# EAGLE design Lawnbot400_arduino3 (EAGLE 5.06)
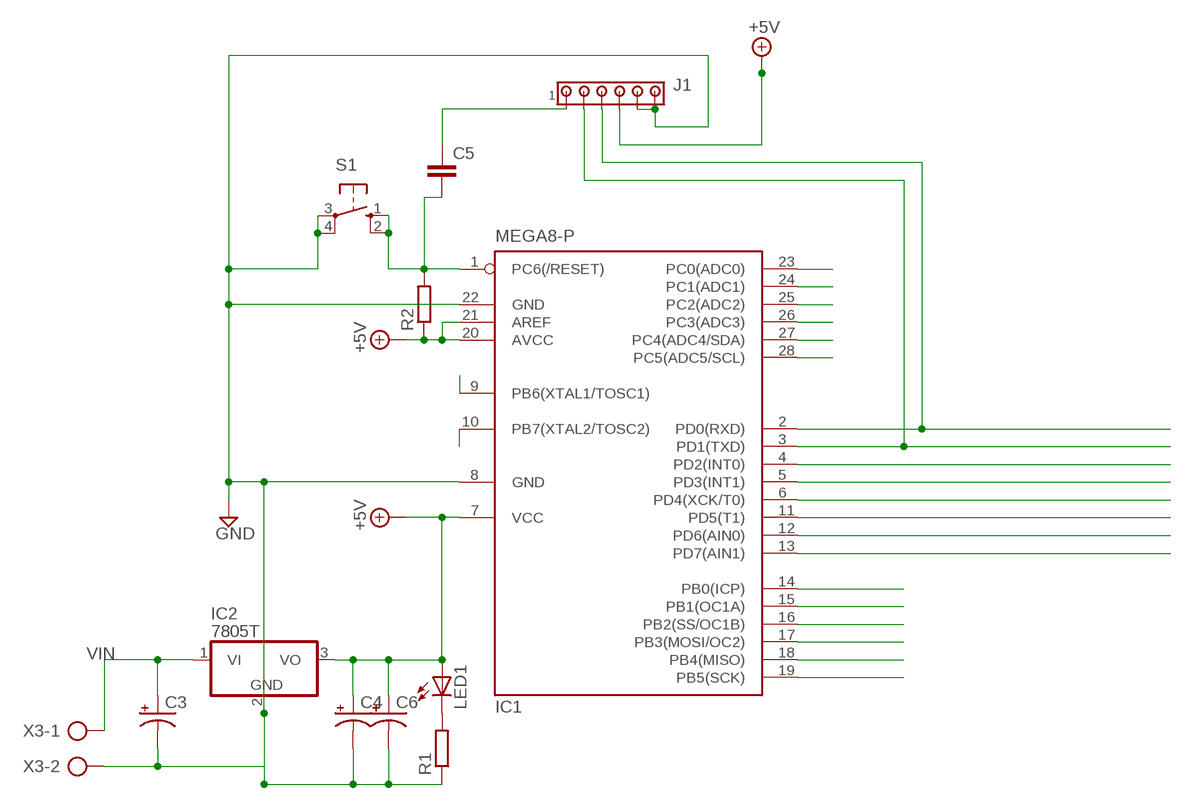
[diagram p0: schematic, sheet 1]

## Parts
C3  CPOL-USE2.5-6  [E2,5-6]
C4  CPOL-USE2.5-7  [E2,5-7]
C5  C-EU075-042X103  [C075-042X103]
C6  CPOL-USE2.5-6  [E2,5-6]
IC1  MEGA8-P  [DIL28-3]
IC2  7805T  [TO220H]
J1  MTA06-100  [10X06MTA]
LED1  LED3MM  [LED3MM]
R1  R-EU_0204/5  [0204/5]
R2  R-EU_0204/5  [0204/5]
S1  10-XX  [B3F-10XX]
X3  AK500/2  [AK500/2]

## Nets
+5V: C4.+ C6.+ IC1.7(VCC) IC1.20(AVCC) IC1.21(AREF) IC2.3(VO) J1.3 LED1.A R2.1
GND: C3.- C4.- C6.- IC1.8(GND) IC1.22(GND) IC2.2(GND) J1.1 J1.2 R1.1 S1.3(P) S1.4(P1) X3.2
N$1: LED1.K(C) R1.2
N$2: C5.2 IC1.1(PC6(/RESET)) R2.2 S1.1(S) S1.2(S1)
N$3: IC1.19(PB5(SCK))
N$4: C5.1 J1.6
N$5: IC1.18(PB4(MISO))
N$6: IC1.17(PB3(MOSI/OC2))
N$7: IC1.9(PB6(XTAL1/TOSC1))
N$8: IC1.4(PD2(INT0))
N$9: IC1.2(PD0(RXD)) J1.4
N$10: IC1.3(PD1(TXD)) J1.5
N$11: IC1.6(PD4(XCK/T0))
N$12: IC1.11(PD5(T1))
N$13: IC1.12(PD6(AIN0))
N$14: IC1.13(PD7(AIN1))
N$15: IC1.14(PB0(ICP))
N$16: IC1.15(PB1(OC1A))
N$17: IC1.5(PD3(INT1))
N$19: IC1.10(PB7(XTAL2/TOSC2))
N$23: IC1.28(PC5(ADC5/SCL))
N$24: IC1.27(PC4(ADC4/SDA))
N$25: IC1.26(PC3(ADC3))
N$26: IC1.25(PC2(ADC2))
N$27: IC1.24(PC1(ADC1))
N$28: IC1.23(PC0(ADC0))
N$29: IC1.16(PB2(SS/OC1B))
VIN: C3.+ IC2.1(VI) X3.1

## Library data of the parts
C3 C4 C6 = rcl:CPOL-US: POLARIZED CAPACITOR, American symbol
C5 = rcl:C-EU: CAPACITOR, European symbol
IC1 = atmel:MEGA8-P: MICROCONTROLLER 8 Kbytes FLASH, 1 kbytes SRAM, 512 bytes EEPROM, USART, 4-channel 10 bit ADC, 2-channel 8 bit ADC Pin compatible with Atmega48, ATMega88, ATMega168 Source: avr.lbr
IC2 = linear:78*: Positive VOLTAGE REGULATOR Source: http://cache.national.com/ds/LM/LM78L05.pdf http://www.fairchildsemi.com/ds/LM/LM7805.pdf
J1 = con-amp:MTA06-100: AMP connector
LED1 = led:LED: LED OSRAM: - CHIPLED LG R971, LG N971, LY N971, LG Q971, LY Q971, LO R971, LY R971 LH N974, LH R974 LS Q976, LO Q976, LY Q976 LO Q996 - Hyper CHIPLED LW Q18S LB Q993, LB Q99A, LB R99A - SideLED LS A670, LO A670, LY A670, LG A670, LP A670 LB A673, LV A673, LT A673, LW A673 LH A674 LY A675 LS A676, LA A676, LO A676, LY A676, LW A676 LS A679, LY A679, LG A679 - Hyper Micro SIDELED® LS Y876, LA Y876, LO Y876, LY Y876 LT Y87S - SmartLED LW L88C, LW L88S LB L89C, LB L89S, LG L890 LS L89K, LO L89K, LY L89K LS L896, LA L896, LO L896, LY L896 - TOPLED LS T670, LO T670, LY T670, LG T670, LP T670 LSG T670, LSP T670, LSY T670, LOP T670, LYG T670 LG T671, LOG T671, LSG T671 LB T673, LV T673, LT T673, LW T673 LH T674 LS T676, LA T676, LO T676, LY T676, LB T676, LH T676, LSB T676, LW T676 LB T67C, LV T67C, LT T67C, LS T67K, LO T67K, LY T67K, LW E67C LS E67B, LA E67B, LO E67B, LY E67B, LB E67C, LV E67C, LT E67C LW T67C LS T679, LY T679, LG T679 LS T770, LO T770, LY T770, LG T770, LP T770 LB T773, LV T773, LT T773, LW T773 LH T774 LS E675, LA E675, LY E675, LS T675 LS T776, LA T776, LO T776, LY T776, LB T776 LHGB T686 LT T68C, LB T68C - Hyper Mini TOPLED® LB M676 - Mini TOPLED Santana® LG M470 LS M47K, LO M47K, LY M47K Source: http://www.osram.convergy.de LUXEON: - LUMILED® LXK2-PW12-R00, LXK2-PW12-S00, LXK2-PW14-U00, LXK2-PW14-V00 LXK2-PM12-R00, LXK2-PM12-S00, LXK2-PM14-U00 LXK2-PE12-Q00, LXK2-PE12-R00, LXK2-PE12-S00, LXK2-PE14-T00, LXK2-PE14-U00 LXK2-PB12-K00, LXK2-PB12-L00, LXK2-PB12-M00, LXK2-PB14-N00, LXK2-PB14-P00, LXK2-PB14-Q00 LXK2-PR12-L00, LXK2-PR12-M00, LXK2-PR14-Q00, LXK2-PR14-R00 LXK2-PD12-Q00, LXK2-PD12-R00, LXK2-PD12-S00 LXK2-PH12-R00, LXK2-PH12-S00 LXK2-PL12-P00, LXK2-PL12-Q00, LXK2-PL12-R00 Source: www.luxeon.com KINGBRIGHT: KA-3528ASYC Source: www.kingbright.com
R1 R2 = resistor:R-EU_: RESISTOR, European symbol
S1 = switch-omron:10-XX: OMRON SWITCH
X3 = con-ptr500:AK500/2: CONNECTOR

## Board
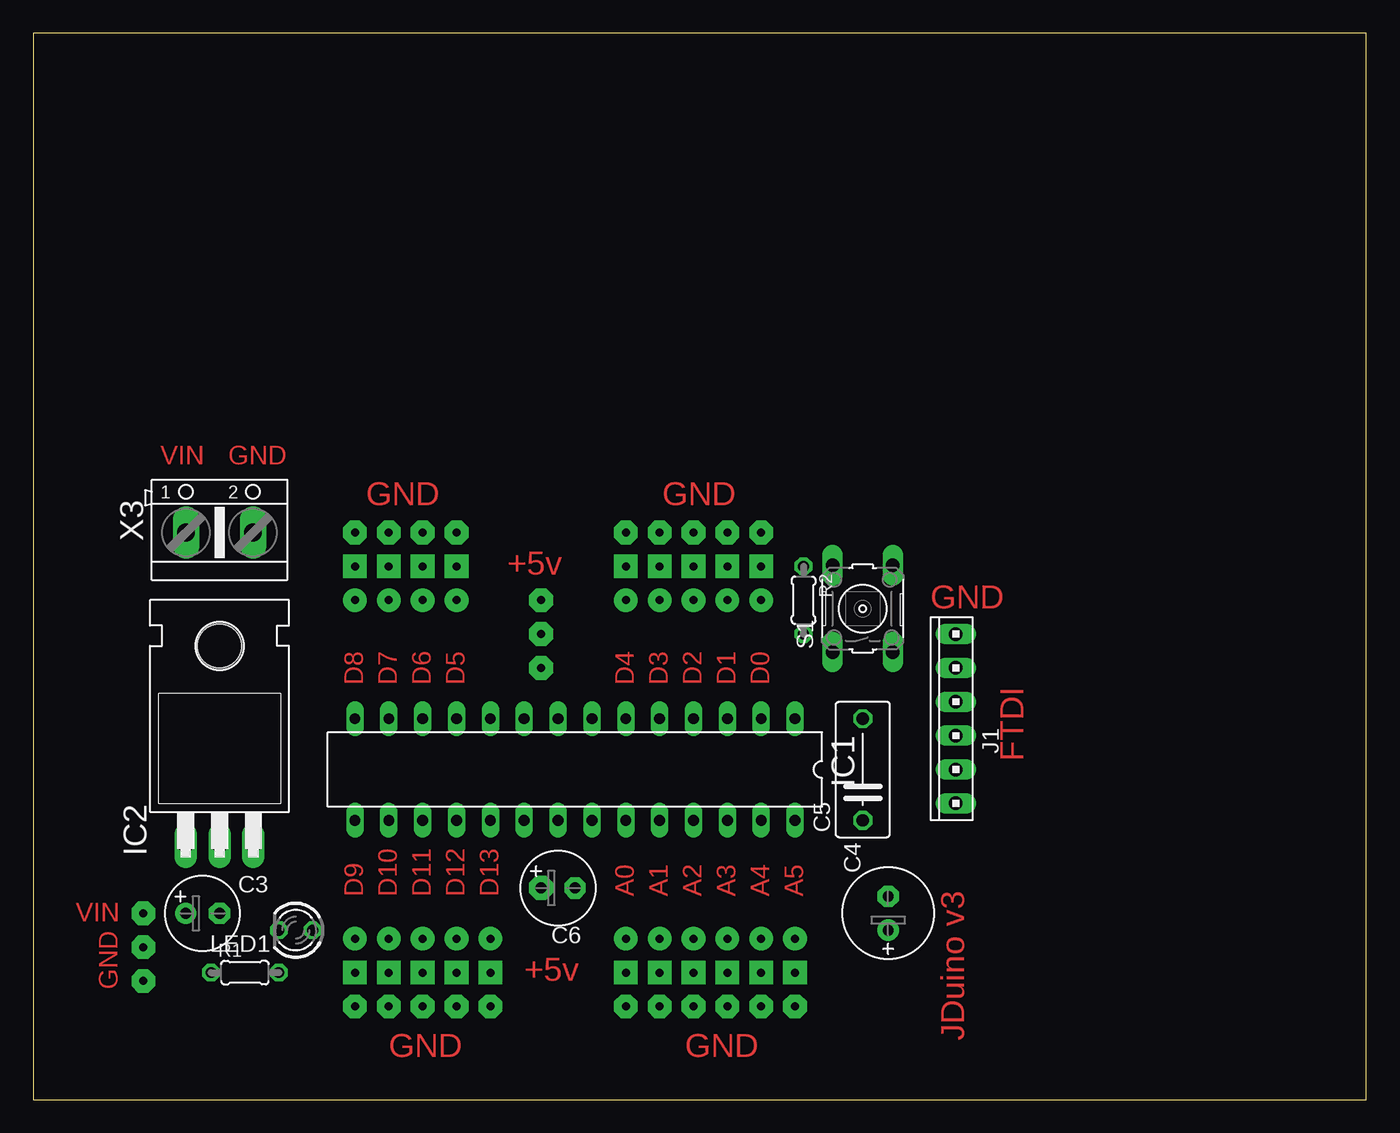
[diagram p1: board, top side]
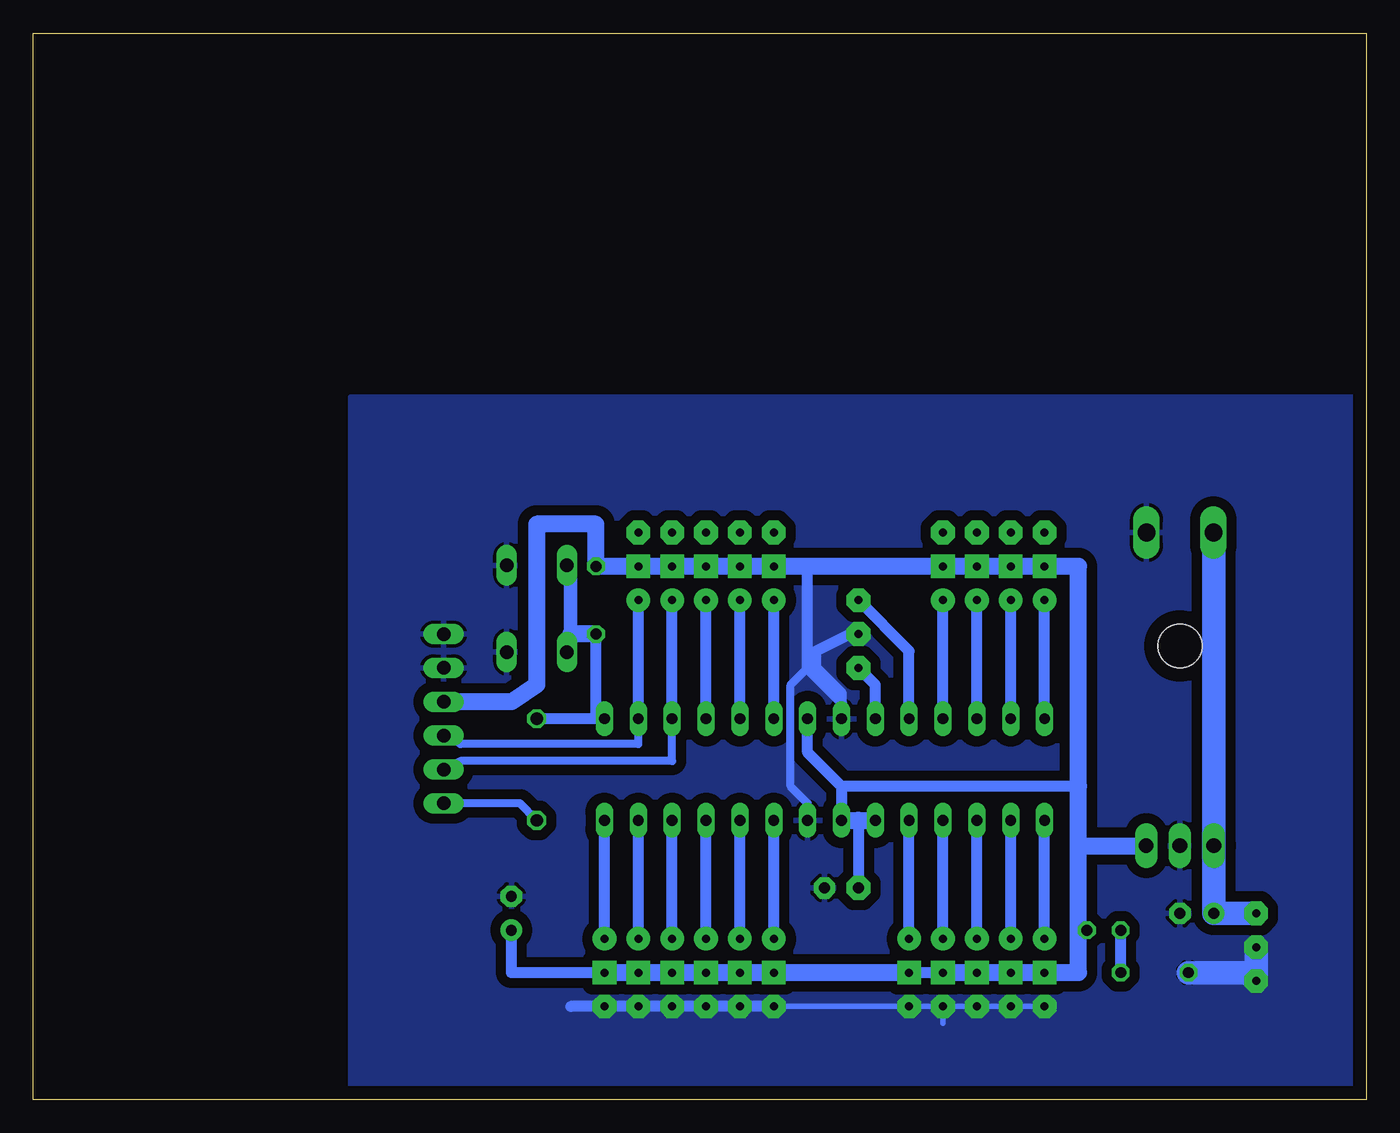
[diagram p2: board, bottom side, seen from below]

Size 100 x 80 mm. Coordinates in mm from the lower left corner, seen from the top.
Outline: 0,0 100,0 100,80 0,80 0,0
Copper layers (1*16): Top 0.035mm / dielectric 1.5mm / Bottom 0.035mm
Design rules "default *": minimum track width 10mil, minimum drill 24mil, track to track 30mil, track to pad 25mil, pad to pad 8mil, via to via 8mil, smd to smd 8mil, copper to edge 40mil, drill to drill 8mil, minimum pad ring 10mil, minimum via ring 8mil, stop-mask expansion 4mil, vias tented up to drill 0mil, thermal gap 10mil

### Footprints (pad centres in the part's own frame; a part is rotated, then mirrored left to right if it is on the bottom)
E2,5-6 = drill 0.813 pad 1.6 round: + -1.27,0 | drill 0.813 pad 1.6 octagon: - 1.27,0
E2,5-7 = drill 0.813 pad 1.6 round: + -1.27,0 | drill 0.813 pad 1.6 octagon: - 1.27,0
C075-042X103 = drill 0.914 octagon: 1 -3.81,0; 2 3.81,0
DIL28-3 = drill 0.813 long: 1 -16.51,-3.81; 2 -13.97,-3.81; 3 -11.43,-3.81; 4 -8.89,-3.81; 5 -6.35,-3.81; 6 -3.81,-3.81; 7 -1.27,-3.81; 8 1.27,-3.81; 9 3.81,-3.81; 10 6.35,-3.81; 11 8.89,-3.81; 12 11.43,-3.81; 13 13.97,-3.81; 14 16.51,-3.81; 15 16.51,3.81; 16 13.97,3.81; 17 11.43,3.81; 18 8.89,3.81; 19 6.35,3.81; 20 3.81,3.81; 21 1.27,3.81; 22 -1.27,3.81; 23 -3.81,3.81; 24 -6.35,3.81; 25 -8.89,3.81; 26 -11.43,3.81; 27 -13.97,3.81; 28 -16.51,3.81
TO220H = drill 1.118 long: 1 -2.54,-10.16; 2 0,-10.16; 3 2.54,-10.16 | hole 3.302: 0,4.826
10X06MTA = drill 1.016 long: 1 6.35,0; 2 3.81,0; 3 1.27,0; 4 -1.27,0; 5 -3.81,0; 6 -6.35,0
LED3MM = drill 0.813 octagon: A -1.27,0; K 1.27,0
0204/5 = drill 0.813 octagon: 1 -2.54,0; 2 2.54,0
B3F-10XX = drill 1.016 long: 1 -3.251,2.261; 2 3.251,2.261; 3 -3.251,-2.261; 4 3.251,-2.261
AK500/2 = drill 1.321 long: 1 -2.515,0; 2 2.515,0

### Placement (x,y rotation side)
C3  12.7,13.97 0 top
C4  64.14,13.97 90 top
C5  62.23,24.77 90 top
C6  39.37,15.88 0 top
IC1  40.64,24.77 180 top
IC2  13.97,29.21 0 top
J1  69.22,28.57 90 top
LED1  19.68,12.7 180 top
R1  15.88,9.53 0 top
R2  57.78,37.47 270 top
S1  62.23,36.83 90 top
X3  13.97,42.55 0 top

### Tracks (layer width: path | path; a pad name or v marks a point on that pad's centre or on a via)
+5V  (via drill 0.6 pad 1.78)
  Bottom 0.406: 31.75,9.53 33.02,9.53
  Bottom 0.813: IC1.7 41.91,26.04 39.37,23.5 | 39.37,23.5 IC1.21 | 21.59,23.5 39.37,23.5 | 31.75,9.53 v34.29,9.53 | 38.1,20.95 C6.+ | C4.+ 64.14,9.53 v57.15,9.53
  Bottom 1.27: IC1.20 38.1,20.95 IC1.21 | v57.15,9.53 v54.61,9.53 v52.07,9.53 v49.53,9.53 v46.99,9.53 v44.45,9.53 v34.29,9.53 | 21.59,9.53 21.59,19.05 | J1.3 64.14,29.84 62.23,31.11 62.23,43.18 57.78,43.18 R2.1 v54.61,40.01 v52.07,40.01 v49.53,40.01 v46.99,40.01 v44.45,40.01 v31.75,40.01 v29.21,40.01 v26.67,40.01 v24.13,40.01 21.59,40.01 21.59,23.5 21.59,19.05 | 31.75,9.53 v29.21,9.53 v26.67,9.53 v24.13,9.53 21.59,9.53 | 21.59,9.53 21.59,12.7 LED1.A | 21.59,19.05 IC2.3
  other vias: 38.1,15.88 38.1,15.88
GND  (via drill 0.6 pad 1.78)
  Bottom 0.406: v24.13,6.99 v26.67,6.99 v29.21,6.99 v31.75,6.99 | v31.75,6.99 31.75,5.71 | v31.75,6.99 v34.29,6.99 v44.45,6.99
  Bottom 0.61: 41.91,32.38 43.18,31.11 43.18,23.5 41.91,22.23 IC1.22
  Bottom 0.813: 41.91,40.01 41.91,32.38 39.37,29.84 IC1.8 39.37,30.48 41.27,32.38 41.27,33.66 38.73,34.92 v38.1,34.92 | v44.45,6.99 v46.99,6.99 v49.53,6.99 v52.07,6.99 v54.61,6.99 v57.15,6.99 59.69,6.99
  Bottom 1.778: v8.26,11.43 v8.26,8.89 8.89,9.53 R1.1
  pour Bottom: 0.64,52.7 76.2,52.7 76.2,0.64 0.64,0.64
N$1
  Bottom 0.813: R1.2 LED1.K
N$2
  Bottom 0.254: 59.69,33.66 S1.1 | 59.69,40.01 S1.2
  Bottom 0.813: 57.78,28.57 C5.2 | IC1.1 57.78,28.57 | 57.78,28.57 R2.2
  Bottom 1.016: 59.69,33.66 59.69,34.92 59.69,40.01
  Bottom 1.27: R2.2 59.69,34.92
N$3  (via drill 0.6 pad 1.78)
  Bottom 0.813: v34.29,12.06 IC1.19
N$4
  Bottom 0.61: C5.1 63.5,22.23 J1.6
N$5  (via drill 0.6 pad 1.78)
  Bottom 0.813: v31.75,12.06 IC1.18
N$6  (via drill 0.6 pad 1.78)
  Bottom 0.813: v29.21,12.06 IC1.17
N$7  (via drill 0.6 pad 1.78)
  Bottom 0.813: IC1.9 36.83,31.11 v38.1,32.38
N$8  (via drill 0.6 pad 1.78)
  Bottom 0.813: IC1.4 v49.53,37.47
N$9  (via drill 0.6 pad 1.78)
  Bottom 0.61: J1.4 67.94,26.67 54.61,26.67 IC1.2
  Bottom 0.813: IC1.2 v54.61,37.47
N$10  (via drill 0.6 pad 1.78)
  Bottom 0.61: J1.5 67.94,25.4 52.07,25.4 IC1.3
  Bottom 0.813: IC1.3 v52.07,37.47
N$11  (via drill 0.6 pad 1.78)
  Bottom 0.813: IC1.6 v44.45,37.47
N$12  (via drill 0.6 pad 1.78)
  Bottom 0.813: IC1.11 v31.75,37.47
N$13  (via drill 0.6 pad 1.78)
  Bottom 0.813: IC1.12 v29.21,37.47
N$14  (via drill 0.6 pad 1.78)
  Bottom 0.813: IC1.13 v26.67,37.47
N$15  (via drill 0.6 pad 1.78)
  Bottom 0.813: IC1.14 v24.13,37.47
N$16  (via drill 0.6 pad 1.78)
  Bottom 0.813: v24.13,12.06 IC1.15
N$17  (via drill 0.6 pad 1.78)
  Bottom 0.813: IC1.5 v46.99,37.47
N$19  (via drill 0.6 pad 1.78)
  Bottom 0.813: IC1.10 34.29,33.66 v38.1,37.47
N$23  (via drill 0.6 pad 1.78)
  Bottom 0.813: v57.15,12.06 IC1.28
N$24  (via drill 0.6 pad 1.78)
  Bottom 0.813: v54.61,12.06 IC1.27
N$25  (via drill 0.6 pad 1.78)
  Bottom 0.813: v52.07,12.06 IC1.26
N$26  (via drill 0.6 pad 1.78)
  Bottom 0.813: v49.53,12.06 IC1.25
N$27  (via drill 0.6 pad 1.78)
  Bottom 0.813: v46.99,12.06 IC1.24
N$28  (via drill 0.6 pad 1.78)
  Bottom 0.813: v44.45,12.06 IC1.23
N$29  (via drill 0.6 pad 1.78)
  Bottom 0.813: v26.67,12.06 IC1.16
N$41  (via drill 0.6 pad 1.78)
  other vias: 31.75,9.53
N$45  (via drill 0.6 pad 1.78)
  other vias: 24.13,42.55
N$46  (via drill 0.6 pad 1.78)
  other vias: 26.67,42.55
N$47  (via drill 0.6 pad 1.78)
  other vias: 29.21,42.55
N$48  (via drill 0.6 pad 1.78)
  other vias: 31.75,42.55
N$49  (via drill 0.6 pad 1.78)
  other vias: 44.45,42.55
N$50  (via drill 0.6 pad 1.78)
  other vias: 46.99,42.55
N$51  (via drill 0.6 pad 1.78)
  other vias: 49.53,42.55
N$52  (via drill 0.6 pad 1.78)
  other vias: 52.07,42.55
N$53  (via drill 0.6 pad 1.78)
  other vias: 54.61,42.55
VIN  (via drill 0.6 pad 1.78)
  Bottom 0.813: 11.43,41.91 X3.1
  Bottom 1.778: 11.43,41.91 IC2.1 C3.+ v8.26,13.97

### Text on the board
Top: VIN | GND | GND | GND | +5v | GND | D8 | D7 | D6 | D5 | D4 | D3 | D2 | D1 | D0 | FTDI | D9 | D10 | D11 | D12 | D13 | A0 | A1 | A2 | A3 | A4 | A5 | VIN | +5v | GND | JDuino v3 | GND | GND